# EasyEDA Pro project TB6612模块.epro

# Schematic Schematic1
Board Name: Board1; Create Date: 2025-08-08; Page Name: P1; Project Name: TB6612模块; Schematic Name: Schematic1; Update Date: 2025-08-08; Company: 嘉立创EDA; Page Size: A4; Version: V1.0
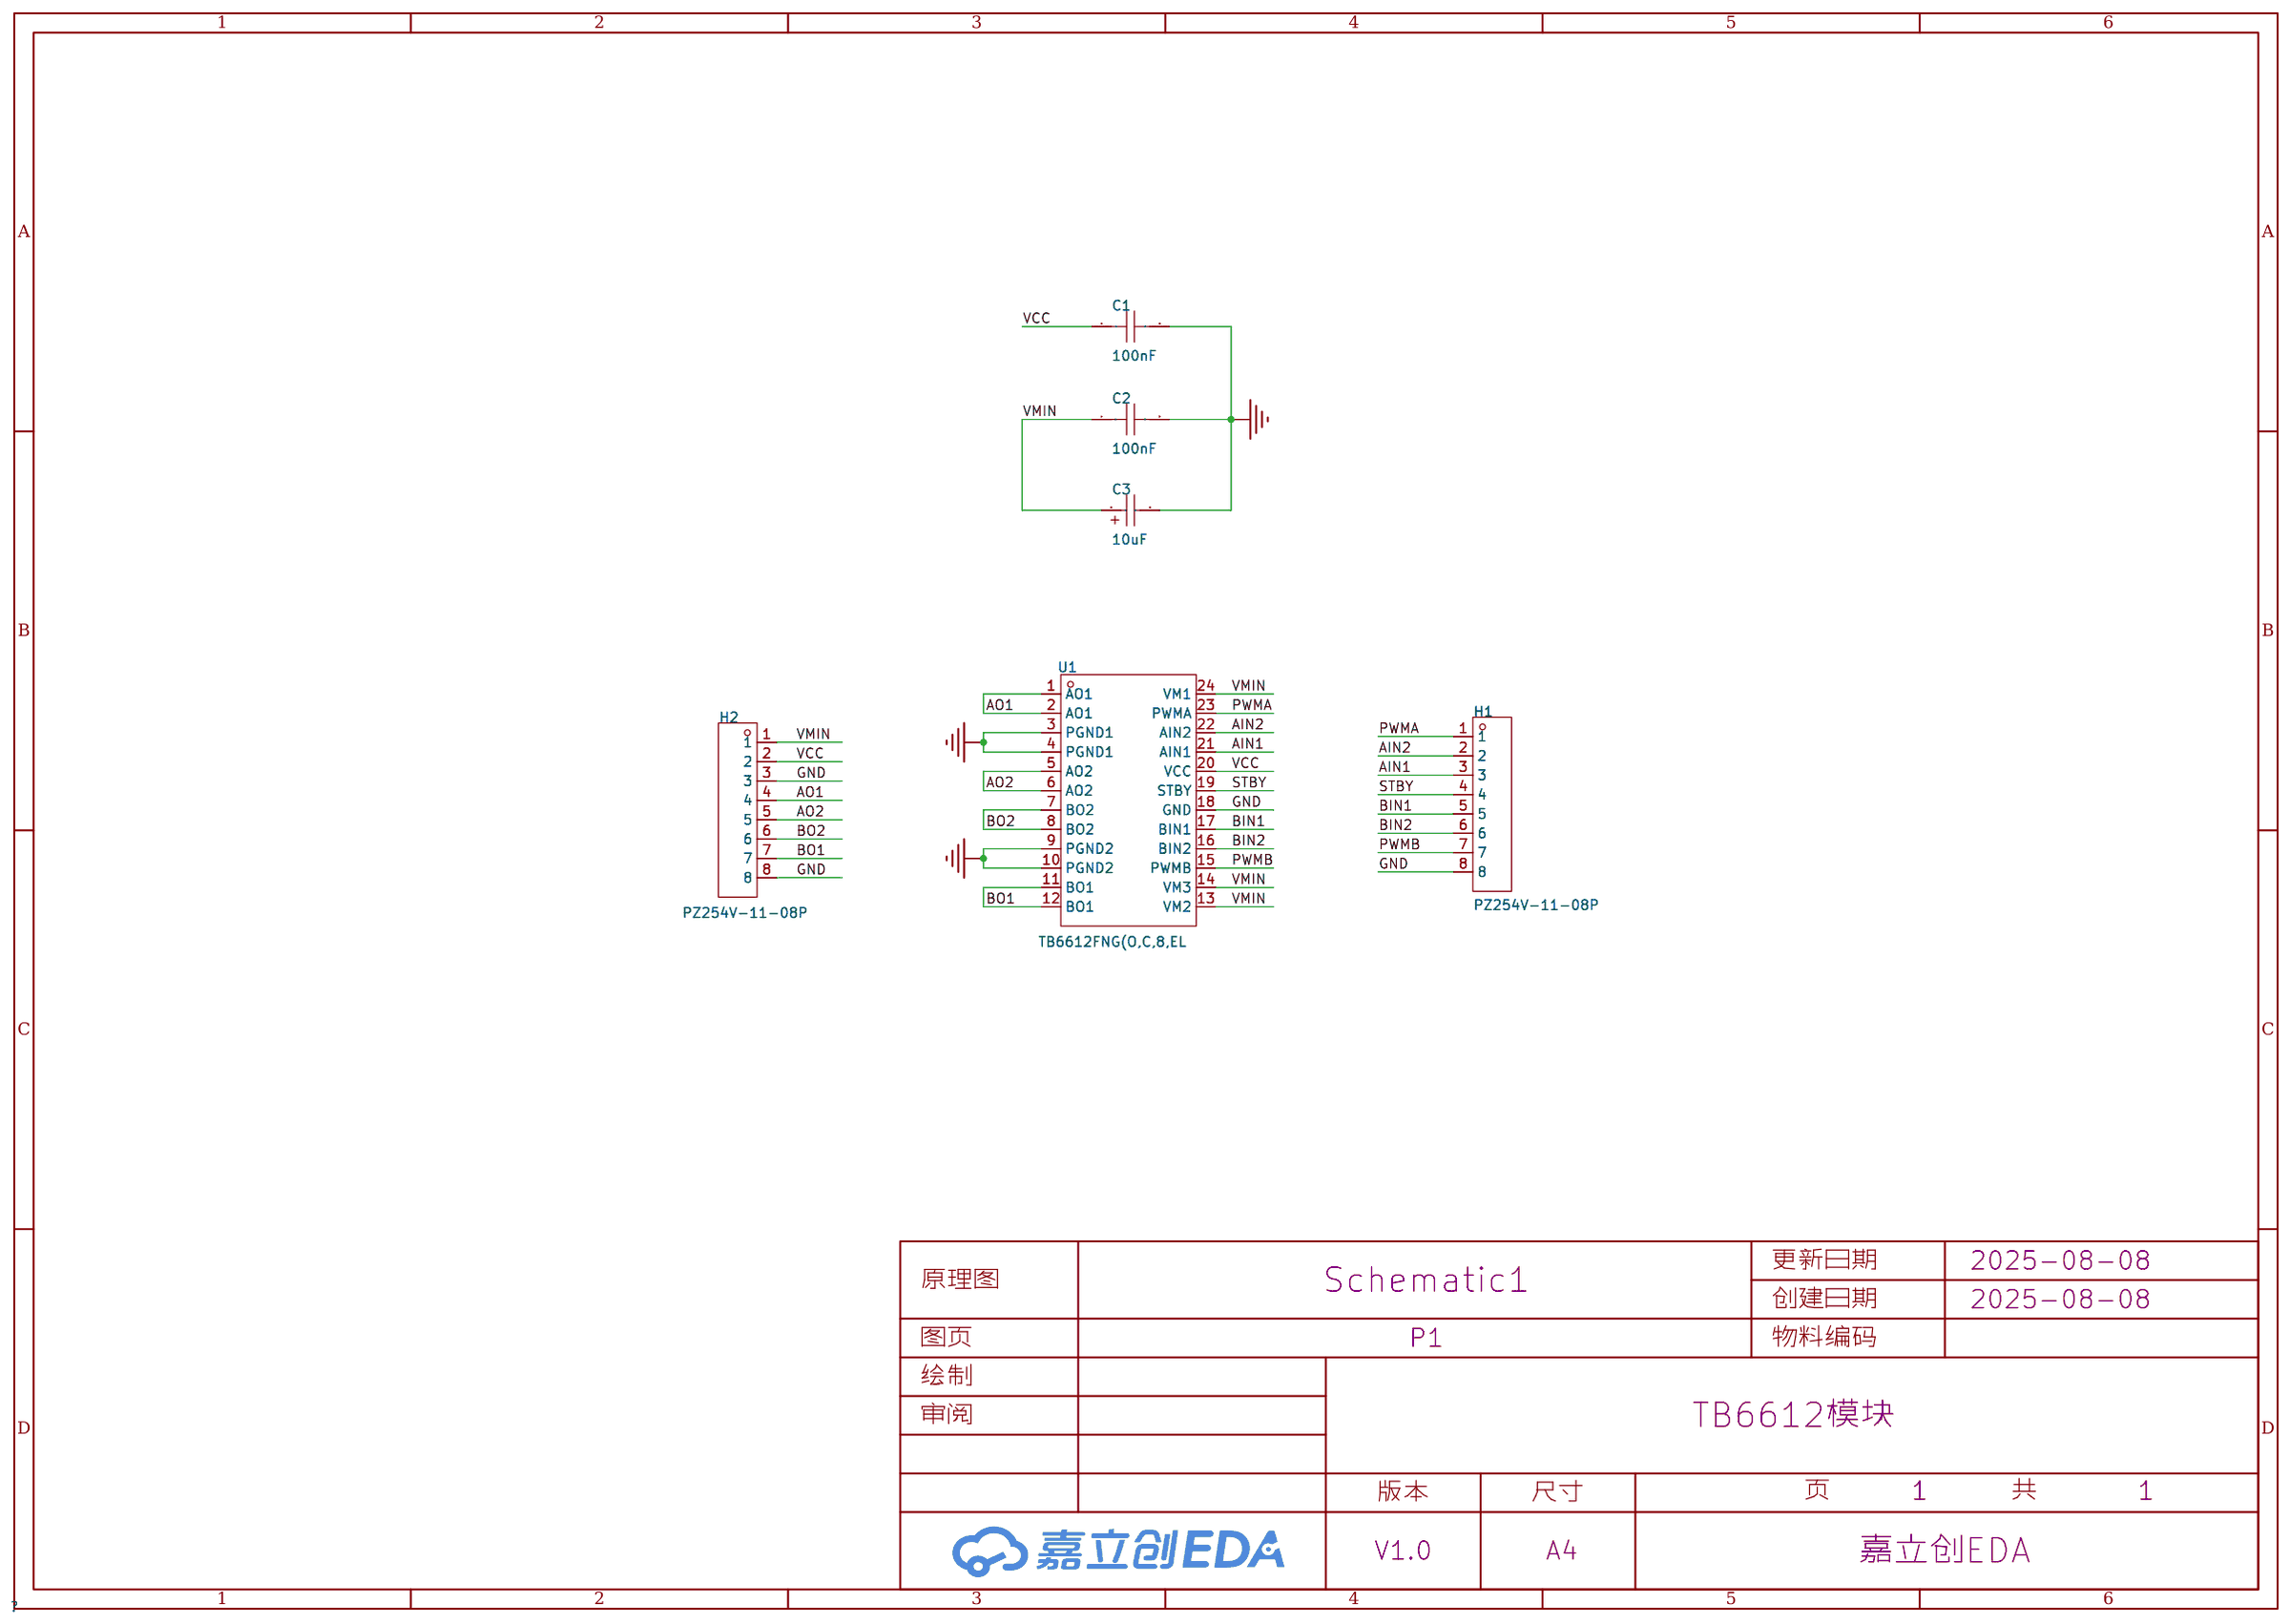
[diagram p0: schematic sheet]

## Parts
C1  100nF  [C0603]
C2  100nF  [C0603]
C3  10uF  [CAP-SMD_L3.2-W1.6-RD-C7171]
H1  PZ254V-11-08P  [HDR-TH_8P-P2.54-V-M]
H2  PZ254V-11-08P  [HDR-TH_8P-P2.54-V-M]
U1  TB6612FNG(O,C,8,EL  [SSOP-24_L8.4-W5.8-P0.65-LS7.8-BL]

## Library data of the parts
C1 C2 = CGA0603X7R104K500JT: 容值:100nF;精度:±10%;额定电压:50V;温度系数:X7R;; LCSC Part Name: 100nF ±10% 50V; Supplier Part: C6119867; Manufacturer: HRE(芯声); Supplier Footprint: 0603; JLCPCB Part Class: 扩展库; Datasheet: https://atta.szlcsc.com/upload/public/pdf/source/20250103/C44077DA9E7B3EFAE02F22B6D3D1CBC9.pdf; Supplier: LCSC; Tolerance: ±10%; Voltage Rating: 50V; Temperature Coefficient: X7R
C3 = TAJA106K016RNJ: 容值:10uF;精度:±10%;额定电压:16V;等效串联电阻(ESR):3Ω@100kHz;; LCSC Part Name: 10uF ±10% 16V; Supplier Part: C7171; Manufacturer: Kyocera AVX; Supplier Footprint: CASE-A-3216-18(mm); JLCPCB Part Class: 基础库; Supplier: LCSC; Tolerance: ±10%; Voltage Rating: 16V; Equivalent Series Resistance(ESR): 3Ω@100kHz; Operating Temperature: -55℃~+125℃
H1 H2 = PZ254V-11-08P: 插针结构:1x8P;间距:2.54mm;行距:-;圆针/方针:方针;安装类型:直插;排数:单排;总PIN位数:8P;额定电流:-;额定电压:-;配合针长度:6mm;塑高:2.5mm;端接针长度:3mm;触头材质:黄铜;触头镀层:-;工作温度范围:-40℃~+105℃;颜色:黑色;; LCSC Part Name: 间距:2.54mm 1x8P 直插 方针; Supplier Part: C492407; Manufacturer: XFCN(兴飞); Supplier Footprint: 插件,P=2.54mm; JLCPCB Part Class: 扩展库; Datasheet: https://atta.szlcsc.com/upload/public/pdf/source/20200309/C492407_83A6FB26A2233368EDB9516968EC6149.pdf; Supplier: LCSC; Pin Structure: 1x8P; Pitch: 2.54mm; Circluar Pins/Square Pins: 方针; Mounting Type: 直插; Number of Rows: 单排; Number of Pins: 8P; Length of Mating Pin: 6mm; Insulation Height: 2.5mm; Length of End Connection Pin: 3mm; Contact Material: 黄铜; Operating Temperature Range: -40℃~+105℃; Color: 黑色
U1 = TB6612FNG(O,C,8,EL: 双直流电机驱动器集成电路; Supplier Part: C88224; Manufacturer: TOSHIBA(东芝); Supplier Footprint: SSOP-24-208mil; JLCPCB Part Class: 扩展库; Datasheet: https://item.szlcsc.com/datasheet/TB6612FNG(O%252CC%252C8%252CEL/89402.html; Supplier: LCSC; RDS(on): 500mΩ; Peak Current: 3.2A; Operating Temperature: -20℃~+85℃

## Nets
GND: C1.2 C2.2 C3.2 H1.8 H2.3 H2.8 U1.3(PGND1) U1.4(PGND1) U1.9(PGND2) U1.10(PGND2) U1.18(GND)
VCC: C1.1 H2.2 U1.20(VCC)
AIN1: H1.3 U1.21(AIN1)
AIN2: H1.2 U1.22(AIN2)
AO1: H2.4 U1.1(AO1) U1.2(AO1)
AO2: H2.5 U1.5(AO2) U1.6(AO2)
BIN1: H1.5 U1.17(BIN1)
BIN2: H1.6 U1.16(BIN2)
BO1: H2.7 U1.11(BO1) U1.12(BO1)
BO2: H2.6 U1.7(BO2) U1.8(BO2)
PWMA: H1.1 U1.23(PWMA)
PWMB: H1.7 U1.15(PWMB)
STBY: H1.4 U1.19(STBY)
VMIN: C2.1 C3.1 H2.1 U1.13(VM2) U1.14(VM3) U1.24(VM1)

# Board PCB1
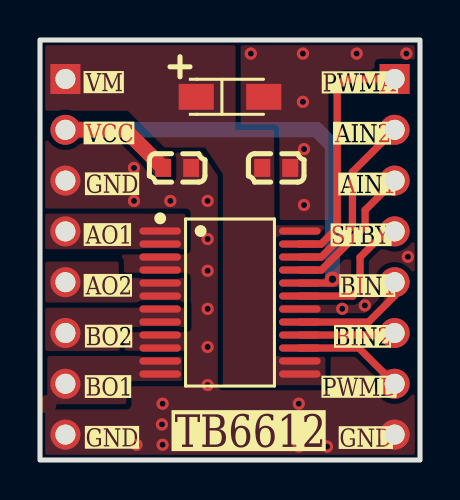
[diagram p1: board, top side]
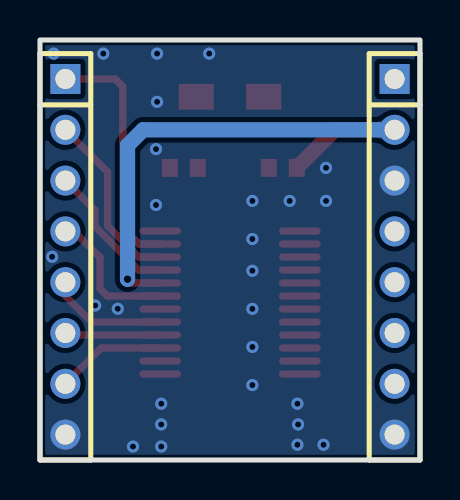
[diagram p2: board, bottom side, seen from below]

Outline 19 x 21 mm; copper layers: Top Layer, Bottom Layer. Coordinates in mm from the lower left corner of the outline.
Outline path: rectangle 0,21 19,0
Stack: Top Layer 0.035mm / Dielectric1 1.51mm FR4 er 4.5 / Bottom Layer 0.035mm

## Design rules (mm)
template: 自定义配置
spacing copperThickness1oz (default): track to track 0.102, other pairs 0.152 to 0.3
spacing copperThickness2oz: track to track 0.203, other pairs 0.152 to 0.3
track width copperThickness1oz (default): min 0.127, default 0.254, max 2.54
track width copperThickness2oz: min 0.203, default 0.254, max 2.54
differential pair differentialPair (default): width min 0.127, default 0.254, max 2.54; gap min 0.152, default 0.152
via viaSize (default): diameter min 0.5, default 0.61, max 10; hole min 0.3, default 0.305, max 6.3

## Placement (name value [footprint] x y rotation side)
C1  100nF  [C0603]  6.86 14.61 0 top
C2  100nF  [C0603]  11.81 14.61 0 top
C3  10uF  [CAP-SMD_L3.2-W1.6-RD-C7171]  9.5 18.16 0 top
H1  PZ254V-11-08P  [HDR-TH_8P-P2.54-V-M]  17.73 10.16 270 bottom
H2  PZ254V-11-08P  [HDR-TH_8P-P2.54-V-M]  1.27 10.16 270 bottom
U1  TB6612FNG(O,C,8,EL  [SSOP-24_L8.4-W5.8-P0.65-LS7.8-BL]  9.5 7.87 270 top

## Footprints (pads in the part's own frame, mm; a bottom-side part is the same pattern mirrored in y, then rotated)
C0603
  rect 0.8x0.9 smd: 1(-0.7,0) 2(0.7,0)
CAP-SMD_L3.2-W1.6-RD-C7171
  rect 1.758x1.296 smd: 1(-1.687,0) 2(1.687,0)
HDR-TH_8P-P2.54-V-M
  rect 1.5x1.5 hole 1: 1(-8.89,0)
  round 1.5 hole 1: 2(-6.35,0) 3(-3.81,0) 4(-1.27,0) 5(1.27,0) 6(3.81,0) 7(6.35,0) 8(8.89,0)
SSOP-24_L8.4-W5.8-P0.65-LS7.8-BL
  oval 0.364x2.082 smd: 1(-3.575,-3.491) 2(-2.925,-3.491) 3(-2.275,-3.491) 4(-1.625,-3.491) 5(-0.975,-3.491) 6(-0.325,-3.491) 7(0.325,-3.491) 8(0.975,-3.491) 9(1.625,-3.491) 10(2.275,-3.491) 11(2.925,-3.491) 12(3.575,-3.491) 13(3.575,3.491) 14(2.925,3.491) 15(2.275,3.491) 16(1.625,3.491) 17(0.975,3.491) 18(0.325,3.491) 19(-0.325,3.491) 20(-0.975,3.491) 21(-1.625,3.491) 22(-2.275,3.491) 23(-2.925,3.491) 24(-3.575,3.491)

## Nets
As in the schematic.

## Via types
v1: diameter 0.762, hole 0.381, Top Layer to Bottom Layer, 1 via
v2: diameter 0.61, hole 0.305, Top Layer to Bottom Layer, 27 vias

## Routing (per net, layer and track width the routed paths; a pad name or vN(x,y) marks a point on that pad's centre or on a via; arc(x,y) is an arc through that point)
GND:
  vias: v2(4.7,14.61) v2(4.7,12.95) v2(4.83,0.76) v2(6.13,2.81) v2(6.1,1.78) v2(6.13,0.76) v2(6.52,12.95) v2(8.38,12.95) v2(8.38,11.05) v2(8.38,9.46) v2(8.38,7.56) v2(8.38,5.65) v2(8.38,3.75) v2(10.54,20.32) v2(12.94,2.81) v2(12.94,1.78) v2(12.94,0.67) v2(13.15,20.32) v2(13.15,17.91) v2(13.2,15.55) v2(13.2,12.75) v2(14.35,0.67) v2(15.11,7.56) v2(15.83,20.32) v2(16.24,7.73) v2(18.32,20.32) v2(18.4,10.16)
VCC: length 27.8
  Top Layer w0.363: U1.20 14.43,8.85 v1(14.62,9.04)
  Top Layer w0.762: C1.1 4.25,16.51 H2.2
  Bottom Layer w0.762: v1(14.62,9.04) 14.62,15.73 13.84,16.51 H2.2
AIN1: length 7.1
  Top Layer w0.363: H1.3 16.26,12.49 16.26,11.68 14.07,9.5 U1.21
AIN2: length 9
  Top Layer w0.363: U1.22 14.06,10.15 15.62,11.71 15.62,14.4 H1.2
BIN1: length 6
  Top Layer w0.363: H1.5 17.73,8.21 16.42,6.9 U1.17
BIN2: length 4.8
  Top Layer w0.363: U1.16 17.63,6.25 H1.6
PWMA: length 12.3
  Top Layer w0.363: 12.99,10.8 13,10.8 14.05,10.8 14.86,11.6 14.86,18.67 15.24,19.05 H1.1
PWMB: length 5.5
  Top Layer w0.363: H1.7 15.94,5.6 12.99,5.6
STBY: length 7
  Top Layer w0.363: H1.4 17.29,11.43 16,10.14 16,8.56 15.64,8.2 U1.19

## Copper pours and planes (outline as drawn; the poured copper is in the pictures)
GND on Top Layer: -0.63,22.35 19.69,22.35 19.69,-0.89 -0.63,-0.89
GND on Bottom Layer: -1.78,21.97 20.19,21.97 20.19,-1.4 -1.78,-1.4
VCC on Top Layer: 14.02,9.1 14.99,10.03 15.75,10.03 15.75,8.56 14.02,8.56
AO1 on Top Layer: 0.25,12.32 7.28,12.32 7.28,10.54 0.25,10.54
AO2 on Top Layer: 7.28,9.11 7.28,7.87 0.01,7.87 0.01,9.92 3.94,9.92 3.94,9.11
BO1 on Top Layer: 0.38,5.21 7.11,5.21 7.11,3.95 4.32,3.95 4.32,2.79 0.36,2.79 0.36,5.19
BO2 on Top Layer: 7.32,6.65 7.32,7.75 -0.08,7.75 -0.08,5.45 3.98,5.45 3.98,6.65
VMIN on Top Layer: 0,20.83 9.78,20.83 9.78,16.51 11.7,16.51 11.72,13.05 11.72,11.74 14.22,11.74 14.22,11.05 11.75,11.05 11.75,5.21 14.27,5.21 14.27,3.74 9.14,3.74 9.14,14.3 8.25,15.62 6.22,15.62 4.38,17.46 0,17.46

Small or netless copper shapes (teardrops, artwork), in the pictures only: 9 on Top Layer, 1 on Bottom Layer

## Text on the board
Top Silkscreen Layer: BO1 | GND | VM | VCC | AO1 | AO2 | BO2 | PWMB | PWMA | STBY | BIN2 | AIN2 | BIN1 | AIN1 | TB6612
